# EAGLE design Proyecto_Reinaldo (EAGLE 7.6.0)
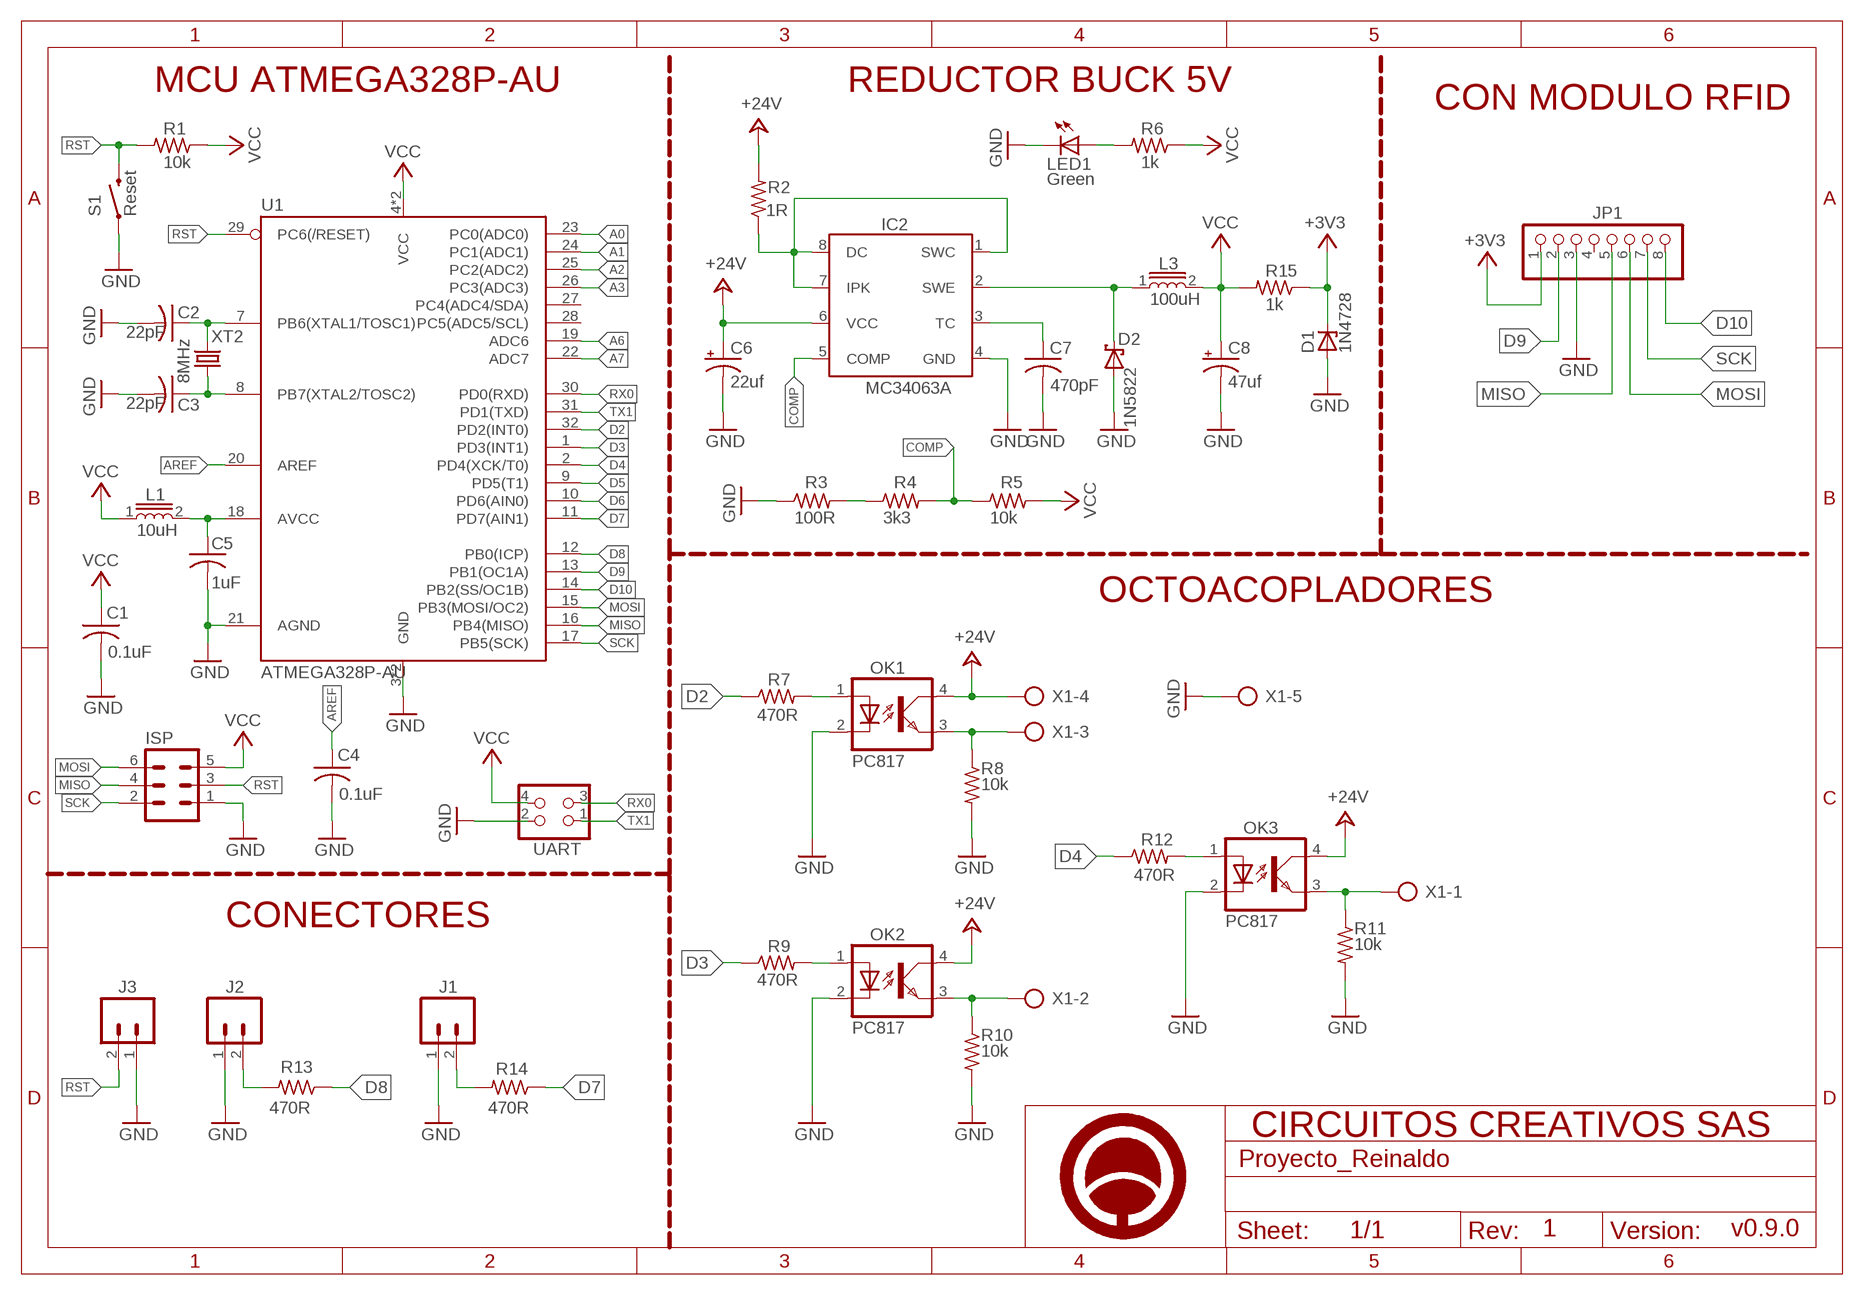
[diagram p0: schematic, sheet 1]

## Parts
C1  0.1uF  C-USC0805  [C0805]
C2  22pF  C-USC0805  [C0805]
C3  22pF  C-USC0805  [C0805]
C4  0.1uF  C-USC0805  [C0805]
C5  1uF  C-USC0805  [C0805]
C6  22uf  CPOL-USE2,5-6E  [E2,5-6E]
C7  470pF  C-USC0805  [C0805]
C8  47uf  CPOL-USE2,5-6E  [E2,5-6E]
D1  1N4728  [DO41Z10]
D2  1N5822  [DO-214AC]
IC2  MC34063A  [SOIC-8]
ISP  MA03-2  [MA03-2]
J1  M02LOCK  [1X02_LOCK]
J2  M02LOCK  [1X02_LOCK]
J3  M02LOCK  [1X02_LOCK]
JP1  PINHD-1X8BIG  [1X08-BIG]
L1  10uH  FERRITA-CHOKE  [L0805]
L3  100uH  CD54  [CD54]
LED1  Green  LEDCHIPLED_0805  [CHIPLED_0805]
OK1  PC817  [DIL04]
OK2  PC817  [DIL04]
OK3  PC817  [DIL04]
R1  10k  RESISTORR1206  [R1206]
R2  1R  RESISTORR1206  [R1206]
R3  100R  RESISTORR1206  [R1206]
R4  3k3  RESISTORR1206  [R1206]
R5  10k  RESISTORR1206  [R1206]
R6  1k  RESISTORR1206  [R1206]
R7  470R  RESISTORR1206  [R1206]
R8  10k  RESISTORR1206  [R1206]
R9  470R  RESISTORR1206  [R1206]
R10  10k  RESISTORR1206  [R1206]
R11  10k  RESISTORR1206  [R1206]
R12  470R  RESISTORR1206  [R1206]
R13  470R  RESISTORR1206  [R1206]
R14  470R  RESISTORR1206  [R1206]
R15  1k  R-US_R1206  [R1206]
S1  Reset  SWITCH-MOMENTARY-2-SMD-1101NE  [TACTILE-SWITCH-1101NE]
U1  ATMEGA328P-AU  [TQFP32]
U$1  A4_HORIZONTAL  [LOGO]
UART  IPS_CIRCUITOS  [ISP_CIRCUITOS]
X1  AK500/5  [AK500/5]
XT2  8MHz  CRYSTALSM49  [SM49]

## Nets
+3V3: D1.C JP1.1 R15.1
+24V: C6.+ IC2.6(VCC) OK1.4(COL) OK2.4(COL) OK3.4(COL) R2.2 X1.4
A0: U1.23(PC0(ADC0))
A1: U1.24(PC1(ADC1))
A2: U1.25(PC2(ADC2))
A3: U1.26(PC3(ADC3))
A6: U1.19(ADC6)
A7: U1.22(ADC7)
AREF: C4.1 U1.20(AREF)
COMP: IC2.5(COMP) R4.2 R5.1
D2: R7.1 U1.32(PD2(INT0))
D3: R9.1 U1.1(PD3(INT1))
D4: R12.1 U1.2(PD4(XCK/T0))
D5: U1.9(PD5(T1))
D6: U1.10(PD6(AIN0))
D7: R14.1 U1.11(PD7(AIN1))
D8: R13.1 U1.12(PB0(ICP))
D9: JP1.2 U1.13(PB1(OC1A))
D10: JP1.8 U1.14(PB2(SS/OC1B))
GND: C1.2 C2.2 C3.2 C4.2 C5.2 C6.- C7.2 C8.- D1.A D2.A IC2.4(GND) ISP.1 J1.1 J2.1 J3.1 JP1.3 LED1.C OK1.2(C) OK2.2(C) OK3.2(C) R3.1 R8.2 R10.2 R11.2 S1.P$1 U1.3(GND) U1.5(GND) U1.21(AGND) UART.2 X1.5
MISO: ISP.4 JP1.5 U1.16(PB4(MISO))
MOSI: ISP.6 JP1.6 U1.15(PB3(MOSI/OC2))
N$1: OK1.1(A) R7.2
N$2: OK2.1(A) R9.2
N$5: OK3.1(A) R12.2
N$8: J2.2 R13.2
N$9: J1.2 R14.2
N$13: LED1.A R6.2
N$14: C7.1 IC2.3(TC)
N$16: IC2.1(SWC) IC2.7(IPK) IC2.8(DC) R2.1
N$17: R3.2 R4.1
N$18: C5.1 L1.2 U1.18(AVCC)
N$19: D2.K IC2.2(SWE) L3.1
OK1: OK1.3(EMIT) R8.1 X1.3
OK2: OK2.3(EMIT) R10.1 X1.2
OK3: OK3.3(EMIT) R11.1 X1.1
OS1: C2.1 U1.7(PB6(XTAL1/TOSC1)) XT2.2
OS2: C3.1 U1.8(PB7(XTAL2/TOSC2)) XT2.1
RST: ISP.3 J3.2 R1.2 S1.P$2 U1.29(PC6(/RESET))
RX0: U1.30(PD0(RXD)) UART.3
SCK: ISP.2 JP1.7 U1.17(PB5(SCK))
TX1: U1.31(PD1(TXD)) UART.1
VCC: C1.1 C8.+ ISP.5 L1.1 L3.2 R1.1 R5.2 R6.1 R15.2 U1.4(VCC) U1.6(VCC) UART.4
Unconnected: JP1.4 U1.27(PC4(ADC4/SDA)) U1.28(PC5(ADC5/SCL))

## Notes on the sheet
- MCU ATMEGA328P-AU | REDUCTOR BUCK 5V
- CON MODULO RFID
- OCTOACOPLADORES
- CONECTORES
- 1 | v0.9.0

## Library data of the parts
C1-C5 C7 = rcl:C-US: CAPACITOR, American symbol
C6 C8 = adafruit:CPOL-US: POLARIZED CAPACITOR, American symbol
D1 = diode:1N4728: Z DIODE 3.3 V, 1W, 5 percent
D2 = Circuitos-Creativos-Diodos:1N5822: Diodo de barrera Schottky Repetitive peak reverse voltage (VRRM): 40V, IRMS: 3A
IC2 = Circuitos-Creativos-Integrados-8pin:MC34063A: Convertidor DC/DC elevador,reductor, inversor 40V - 1.5A
ISP = con-lstb:MA03-2: PIN HEADER; OC_FARNELL: unknown; OC_NEWARK: unknown
J1-J3 = SparkFun-Connectors:M02: Standard 2-pin 0.1" header. Use with - straight break away headers ( PRT-00116) - right angle break away headers (PRT-00553) - swiss pins (PRT-00743) - machine pins (PRT-00117) - female headers (PRT-00115) Molex polarized connector foot print use with: PRT-08233 with associated crimp pins and housings. 2.54_SCREWTERM for use with PRT-10571. 3.5mm Screw Terminal footprints for PRT-08084 5mm Screw Terminal footprints for use with PRT-08432
JP1 = adafruit:PINHD-1X8: PIN HEADER
L1 = Circuitos-Creativos-RCL:FERRITA-CHOKE: Inductor para altas frecuencias 47nH - 50mOhms
L3 = Circuitos-Creativos-RCL:CD54: Power inductor SMD de la serie CD54
LED1 = led:LED: LED OSRAM: - CHIPLED LG R971, LG N971, LY N971, LG Q971, LY Q971, LO R971, LY R971 LH N974, LH R974 LS Q976, LO Q976, LY Q976 LO Q996 - Hyper CHIPLED LW Q18S LB Q993, LB Q99A, LB R99A - SideLED LS A670, LO A670, LY A670, LG A670, LP A670 LB A673, LV A673, LT A673, LW A673 LH A674 LY A675 LS A676, LA A676, LO A676, LY A676, LW A676 LS A679, LY A679, LG A679 - Hyper Micro SIDELED® LS Y876, LA Y876, LO Y876, LY Y876 LT Y87S - SmartLED LW L88C, LW L88S LB L89C, LB L89S, LG L890 LS L89K, LO L89K, LY L89K LS L896, LA L896, LO L896, LY L896 - TOPLED LS T670, LO T670, LY T670, LG T670, LP T670 LSG T670, LSP T670, LSY T670, LOP T670, LYG T670 LG T671, LOG T671, LSG T671 LB T673, LV T673, LT T673, LW T673 LH T674 LS T676, LA T676, LO T676, LY T676, LB T676, LH T676, LSB T676, LW T676 LB T67C, LV T67C, LT T67C, LS T67K, LO T67K, LY T67K, LW E67C LS E67B, LA E67B, LO E67B, LY E67B, LB E67C, LV E67C, LT E67C LW T67C LS T679, LY T679, LG T679 LS T770, LO T770, LY T770, LG T770, LP T770 LB T773, LV T773, LT T773, LW T773 LH T774 LS E675, LA E675, LY E675, LS T675 LS T776, LA T776, LO T776, LY T776, LB T776 LHGB T686 LT T68C, LB T68C - Hyper Mini TOPLED® LB M676 - Mini TOPLED Santana® LG M470 LS M47K, LO M47K, LY M47K Source: http://www.osram.convergy.de LUXEON: - LUMILED® LXK2-PW12-R00, LXK2-PW12-S00, LXK2-PW14-U00, LXK2-PW14-V00 LXK2-PM12-R00, LXK2-PM12-S00, LXK2-PM14-U00 LXK2-PE12-Q00, LXK2-PE12-R00, LXK2-PE12-S00, LXK2-PE14-T00, LXK2-PE14-U00 LXK2-PB12-K00, LXK2-PB12-L00, LXK2-PB12-M00, LXK2-PB14-N00, LXK2-PB14-P00, LXK2-PB14-Q00 LXK2-PR12-L00, LXK2-PR12-M00, LXK2-PR14-Q00, LXK2-PR14-R00 LXK2-PD12-Q00, LXK2-PD12-R00, LXK2-PD12-S00 LXK2-PH12-R00, LXK2-PH12-S00 LXK2-PL12-P00, LXK2-PL12-Q00, LXK2-PL12-R00 Source: www.luxeon.com KINGBRIGHT: KA-3528ASYC Source: www.kingbright.com
OK1-OK3 = optocoupler:PC817: SHARP OPTO COUPLER; MPN: PC817X4J000F; OC_FARNELL: 9707727; OC_NEWARK: 97K7059
R1-R14 = Circuitos-Creativos-RCL:RESISTOR: RESISTOR, simbolo Americano
R15 = rcl:R-US_: RESISTOR, American symbol
S1 = Testing:SWITCH-MOMENTARY-2: Various NO switches- pushbuttons, reed, etc
U1 = Circuitos-Creativos-Integrados-MCUs:ATMEGA328P: Microcontrolador AVR de 8 bits 32KB memoria Flash
U$1 = Circuitos-Creativos-Estilos:A4_HORIZONTAL
UART = isp_circuitos:IPS_CIRCUITOS
X1 = con-ptr500:AK500/5: CONNECTOR; OC_FARNELL: unknown; OC_NEWARK: unknown
XT2 = crystal:CRYSTAL: CRYSTAL; OC_FARNELL: unknown; OC_NEWARK: unknown

## Board
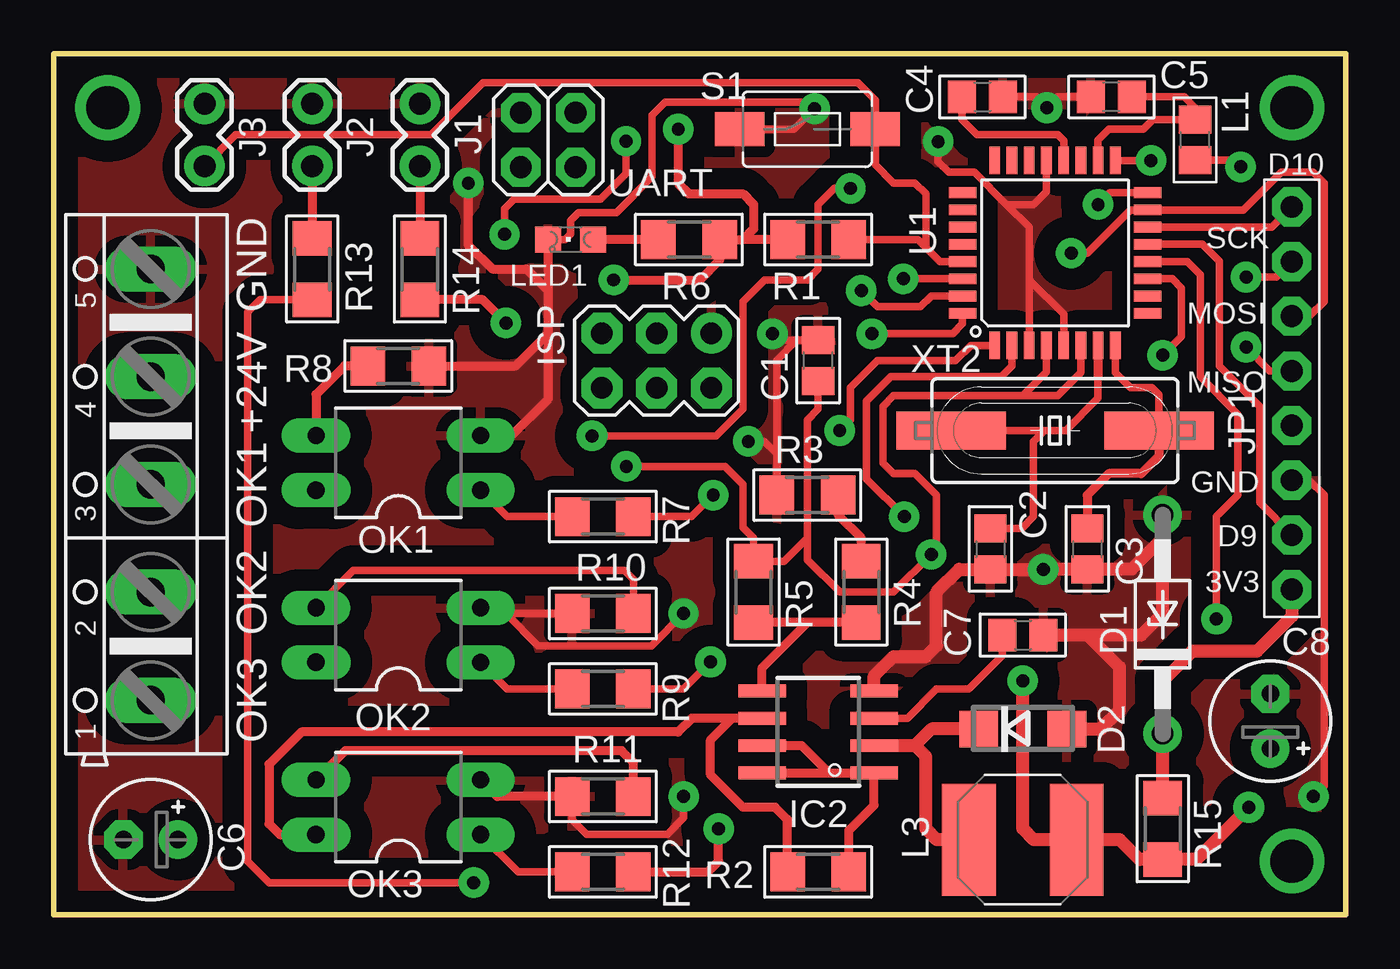
[diagram p1: board, top side]
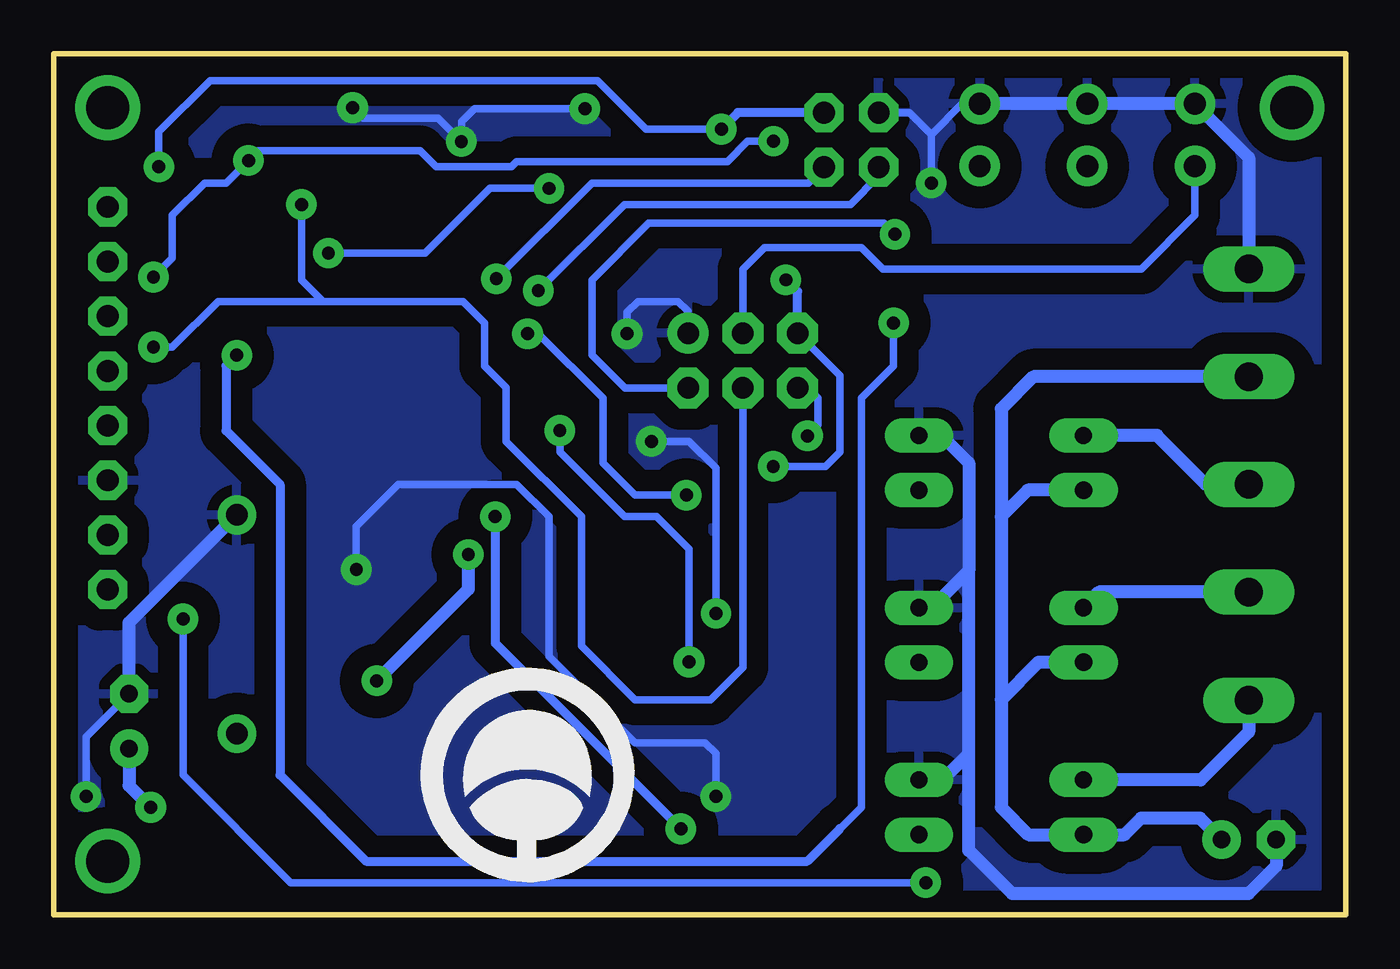
[diagram p2: board, bottom side, seen from below]

Size 60 x 40 mm. Coordinates in mm from the lower left corner, seen from the top.
Outline: 0,0 60,0 60,40 0,40 0,0
Copper layers (1*16): Top 0.035mm / dielectric 1.5mm / Bottom 0.035mm
Design rules "Crcuitos creativos *": minimum track width 0.35mm, minimum drill 0.6mm, track to track 10mil, track to pad 10mil, pad to pad 10mil, via to via 10mil, smd to smd 8mil, copper to edge 0.5mm, drill to drill 0.3mm, minimum pad ring 0.4mm, minimum via ring 0.4mm, stop-mask expansion 4mil, vias tented up to drill 0mil, thermal gap 20mil

### Footprints (pad centres in the part's own frame; a part is rotated, then mirrored left to right if it is on the bottom)
C0805 = smd 1.3 x 1.5: 1 -0.95,0; 2 0.95,0
E2,5-6E = drill 0.813 pad 1.778: + -1.27,0 | drill 0.813 pad 1.778 octagon: - 1.27,0
DO41Z10 = drill 1 pad 1.778: A 5.08,0; C -5.08,0
DO-214AC = smd 1.8 x 1.7: A 2.05,0; K -2.05,0
SOIC-8 = smd 0.6 x 2.2: 1 -1.905,-2.6; 2 -0.635,-2.6; 3 0.635,-2.6; 4 1.905,-2.6; 5 1.905,2.6; 6 0.635,2.6; 7 -0.635,2.6; 8 -1.905,2.6
MA03-2 = drill 1 pad 1.9: 1 -2.54,-1.27 | drill 1 pad 1.9 octagon: 2 -2.54,1.27; 3 0,-1.27; 4 0,1.27; 5 2.54,-1.27; 6 2.54,1.27
1X02_LOCK = drill 1.016 pad 1.88: 1 -0.178,0; 2 2.718,0
1X08-BIG = drill 1.016 pad 1.778 octagon: 1 -8.89,0; 2 -6.35,0; 3 -3.81,0; 4 -1.27,0; 5 1.27,0; 6 3.81,0; 7 6.35,0; 8 8.89,0
L0805 = smd 1.3 x 1.5: 1 -0.95,0; 2 0.95,0
CD54 = smd 5.2 x 2.5: 1 0,2.5; 2 0,-2.5
CHIPLED_0805 = smd 1.2 x 1.2: A 0,-1.05; C 0,1.05
DIL04 = drill 0.8 long: 1 -1.27,-3.82; 2 1.27,-3.82; 3 1.27,3.82 | drill 0.813 long: 4 -1.27,3.82
R1206 = smd 1.6 x 1.803: 1 -1.422,0; 2 1.422,0
TACTILE-SWITCH-1101NE = smd 2.3 x 1.6: P$1 -3.15,0; P$2 3.15,0
TQFP32 = smd 1.27 x 0.5: 1 -4.293,2.8; 2 -4.293,2; 3 -4.293,1.2; 4 -4.293,0.4; 5 -4.293,-0.4; 6 -4.293,-1.2; 7 -4.293,-2; 8 -4.293,-2.8; 17 4.293,-2.8; 18 4.293,-2; 19 4.293,-1.2; 20 4.293,-0.4; 21 4.293,0.4; 22 4.293,1.2; 23 4.293,2; 24 4.293,2.8 | smd 0.5 x 1.27: 9 -2.8,-4.293; 10 -2,-4.293; 11 -1.2,-4.293; 12 -0.4,-4.293; 13 0.4,-4.293; 14 1.2,-4.293; 15 2,-4.293; 16 2.8,-4.293; 25 2.8,4.293; 26 2,4.293; 27 1.2,4.293; 28 0.4,4.293; 29 -0.4,4.293; 30 -1.2,4.293; 31 -2,4.293; 32 -2.8,4.293
ISP_CIRCUITOS = drill 1.016 pad 1.676 octagon: 1 -3.81,-1.27; 2 -3.81,1.27; 3 -1.27,-1.27; 4 -1.27,1.27
AK500/5 = drill 1.321 long: 1 -10.033,0; 2 -5.004,0; 3 0,0; 4 5.004,0; 5 10.008,0
SM49 = smd 5.08 x 1.778: 1 -4.826,0; 2 4.826,0

### Placement (x,y rotation side)
C1  35.5,25.75 90 top
C2  43.5,17 270 top
C3  48,17 270 top
C4  43.12,38 0 top
C5  49.12,38 180 top
C6  4.5,3.5 180 top
C7  45,13 0 top
C8  56.5,9 90 top
D1  51.5,13.5 90 top
D2  45,8.63 0 top
IC2  35.5,8.5 90 top
ISP  28,25.75 180 top
J1  17,37.5 270 top
J2  12,37.5 270 top
J3  7,37.5 270 top
JP1  57.5,24 90 top
L1  53,36 90 top
L3  45,3.5 90 top
LED1  24,31.38 90 top
OK1  16,21 90 top
OK2  16,13 90 top
OK3  16,5 90 top
R1  35.5,31.38 0 top
R2  35.5,2 180 top
R3  35,19.5 0 top
R4  37.5,15 270 top
R5  32.5,15 90 top
R6  29.5,31.38 180 top
R7  25.5,18.5 180 top
R8  16,25.5 0 top
R9  25.5,10.5 180 top
R10  25.5,14 180 top
R11  25.5,5.5 180 top
R12  25.5,2 180 top
R13  12,30 90 top
R14  17,30 90 top
R15  51.5,4 270 top
S1  35,36.5 0 top
U1  46.5,30.75 90 top
U$1  38,6.5 0 bottom
UART  25.5,36 0 top
X1  4.5,20 90 top
XT2  46.5,22.5 180 top

### Tracks (layer width: path | path; a pad name or v marks a point on that pad's centre or on a via)
+3V3
  Top 0.61: R15.1 D1.C 51.5,10.88 52.88,12.25 55.88,12.25 57.5,13.88 JP1.1
+24V
  Top 0.406: IC2.6 31.5,9.13 | 31.5,9.13 29.64,9.13 29,8.5 11.5,8.5 10,7 10,4.23 10.5,3.73 OK3.4 | R2.2 34.08,4.42 33.5,5 32,5 30.5,6.5 30.5,8.13 31.5,9.13
  Bottom 0.61: OK1.4 14.77,19.73 16,18.5 | 16,18.5 16,10 | 16,10 16,5 14.73,3.73 OK3.4 10.27,3.73 9.5,4.5 6.77,4.5 C6.+ | OK2.4 14.27,11.73 16,10 | X1.4 14.5,25 16,23.5 16,18.5
AREF
  Top 0.35: U1.20 46.9,35.98 46.62,36.25 42.88,36.25 42.17,36.95 C4.1
COMP
  Top 0.406: R4.2 35,13.58 | 35,13.58 R5.1 | IC2.5 32.9,11.48 35,13.58
D2  (via drill 0.6 pad 1.42)
  Top 0.35: U1.32 42.21,27.46 41.75,27 v38,27 | R7.1 29.62,18.5 v30.62,19.5
  Bottom 0.35: v30.62,19.5 33,19.5 34.5,21 34.5,24 37.5,27 v38,27
D3  (via drill 0.6 pad 1.42)
  Top 0.35: U1.1 42.58,26.46 41.88,25.75 38.25,25.75 37,24.5 37,23 v36.5,22.5 | R9.1 29.25,10.5 v30.5,11.75
  Bottom 0.35: v36.5,22.5 36.5,21.5 33.5,18.5 32,18.5 30.5,17 v30.5,11.75
D4  (via drill 0.6 pad 1.42)
  Top 0.35: U1.2 44.5,25.5 44,25 38.88,25 37.75,23.88 37.75,20.25 v39.5,18.5
  Top 0.406: R12.1 30.38,2 30.88,2.5 v30.88,4
  Bottom 0.406: v39.5,18.5 39.5,12.62 v30.88,4
D7  (via drill 0.6 pad 1.42)
  Top 0.35: U1.11 51.95,29.55 52.38,29.12 52.38,26.88 v51.5,26
  Top 0.406: v21,27.5 19.92,28.58 R14.1
  Bottom 0.35: v21,27.5 21,25.5 22.5,24 22.5,5 23.5,4
  Bottom 0.406: 23.5,4 25,2.5 45.5,2.5 49.5,6.5 49.5,20 52,22.5 52,25.5 v51.5,26
D8  (via drill 0.6 pad 1.42)
  Top 0.35: U1.12 52.65,30.35 53.25,29.75 53.25,25 55,23.25 55,19.5 54,18.5 v54,13.75 | R13.1 9.58,28.58 9,28 9,2.5 10,1.5 v19.5,1.5
  Bottom 0.35: v19.5,1.5 49,1.5 54,6.5 v54,13.75
D9
  Top 0.35: U1.13 53.35,31.15 54.12,30.38 54.12,25.5 56,23.62 56,19.15 JP1.2
D10
  Top 0.35: U1.14 56.56,31.95 JP1.8
GND  (via drill 0.6, 0.6 pad 1.42)
  Top 0.35: JP1.3 58.31,20.19 59,19.5 59,6 v58.5,5.5 | C1.2 34.5,26.7 | 34.5,26.7 33.67,26.7 v33.38,27 | U1.3 45.3,29.5 | 45.3,29.5 45.3,31.95 44.25,33 | U1.5 46.9,27.9 45.3,29.5 | C5.2 46.62,38 v46.12,37.5 45.62,38 C4.2 | U1.21 46.1,33.6 45.5,33 44.25,33 | 44.25,33 42.75,34.5 41.57,34.5 41.07,35 v41.07,35.93 | R11.2 24.08,4.42 24.75,3.75 28.5,3.75 29.25,4.5 v29.25,5.5 | LED1.C 23.75,31.38 24,31.62 24,32.25 24.38,32.62 26.12,32.62 27.78,34.28 27.78,37.15 28.39,37.75 35.03,37.75 v35.33,37.45 34.39,36.5 S1.P$1 | v29.25,14 27.75,12.5 22.5,12.5 21,14 | R10.2 21,14 | 21,14 20.09,14 OK2.2 | v32.25,22 33,22 33.58,21.42 | 33.58,21.42 33.58,25.78 34.5,26.7 | 33.58,21.42 R3.1
  Top 0.406: LED1.C 22.95,29 | 22.95,29 22.95,27 | 22.95,27 22.95,23.95 21.27,22.27 OK1.2 | R8.2 21.45,25.5 22.95,27 | R11.2 20.59,5.5 OK3.2 | v19.25,34 19.25,31.12 20.38,30 21.95,30 22.95,29
  Top 0.61: D1.A 51.5,17.5 | 51.5,17.5 50.05,16.05 C3.2 v45.95,16.05 C2.2 42.05,16.05 41,15 41,12.5 40.5,12 39,12 38.1,11.1 IC2.4 | C7.2 48,13 | 48,13 50.5,13 51.5,14 51.5,17.5 | D2.A 48.63,8.63 49.5,9.5 49.5,11.5 48,13
  Bottom 0.35: v58.5,5.5 58.5,8.27 C8.- | v33.38,27 33.38,28 32.88,28.5 31,28.5 30.54,28.04 ISP.1 | v46.12,37.5 45.62,37 42.14,37 v41.07,35.93 41.07,36.84 40.47,37.45 v35.33,37.45 | v29.25,5.5 29.25,7.5 29.75,8 33,8 37,12 37,18.5 38.5,20 44,20 45.95,18.05 v45.95,16.05 | UART.2 20.27,37.27 19.25,36.25 | 19.25,36.25 v19.25,34 | J1.1 17.82,37.68 19.25,36.25 | v29.25,14 29.25,20.75 30.5,22 v32.25,22
  Bottom 0.61: OK3.2 18.73,6.27 17.5,7.5 | 17.5,7.5 17.5,16 | OK2.2 19.23,14.27 17.5,16 | OK1.2 18.77,22.27 17.5,21 17.5,16 | C6.- 3.23,2.27 4.5,1 15.5,1 17.5,3 17.5,7.5 | J1.1 J2.1 J3.1 4.5,35.18 X1.5 | C8.- 56.5,13.58 D1.A
  pour Bottom (isolate 1): -1,-1 61,-1 61,41 -1,41
  pour Top (isolate 1): -0.5,-0.5 60.5,-0.5 60.5,40.5 -0.5,40.5
MISO  (via drill 0.6 pad 1.42)
  Top 0.35: U1.16 49.05,33.55 v48.5,33 | JP1.5 56.48,25.27 v55.38,26.38
  Bottom 0.35: v48.5,33 48.5,29.5 47.5,28.5 | 47.5,28.5 52.38,28.5 54.5,26.38 v55.38,26.38 | 47.5,28.5 41,28.5 40,27.5 40,25.5 39,24.5 39,22 35.5,18.5 35.5,12.5 33,10 29.5,10 28,11.5 ISP.4
MOSI  (via drill 0.6, 0.6 pad 1.42)
  Top 0.35: v47.25,30.75 48,30.75 50,32.75 U1.15 55.25,32.75 57,34.5 58.5,34.5 59,34 59,28.5 58.31,27.81 JP1.6 | v37,33.75 36.25,33.75 35.5,33 35.5,30 35,29.5 33,29.5 32,28.5 32,23.5 30.75,22.25 v25,22.25
  Bottom 0.35: v37,33.75 39.75,33.75 42.75,30.75 v47.25,30.75 | ISP.6 24.98,24.48 24.5,24 24.5,22.75 v25,22.25
N$1
  Top 0.35: R7.2 21.05,18.5 OK1.1
N$2
  Top 0.35: R9.2 21.05,10.5 OK2.1
N$5
  Top 0.35: R12.2 21.55,2 OK3.1
N$8
  Top 0.406: J2.2 R13.2
N$9
  Top 0.406: J1.2 R14.2
N$10  (via drill 2 pad 3)
  other vias: 2.5,37.5
N$12  (via drill 2 pad 3)
  other vias: 57.5,2.5
N$13
  Top 0.406: R6.2 LED1.A
N$14
  Top 0.35: C7.1 44.05,12.05 42.5,10.5 41,10.5 39.63,9.13 IC2.3
N$15  (via drill 2 pad 3)
  other vias: 57.5,37.5
N$16
  Top 0.406: IC2.8 36,6.59 | 36,6.59 IC2.1 38.1,5.1 36.92,3.92 R2.1 | IC2.7 34.73,7.87 36,6.59
N$17
  Top 0.406: R4.1 37.5,17.5 36.42,18.58 R3.2
N$18
  Top 0.35: U1.18 48.5,36 49,36.5 50.6,36.5 51.05,36.95 L1.2 53,37.5 52.5,38 C5.1
N$19
  Top 0.61: IC2.2 40,7.87 | D2.K 40.77,8.63 40,7.87 | L3.1 41,3.5 40.5,4 40.5,7.37 40,7.87
OK1
  Top 0.406: R8.1 13.5,25.5 12.18,24.18 OK1.3
  Bottom 0.61: X1.3 6.5,20 8.77,22.27 OK1.3
OK2
  Top 0.35: R10.1 26.92,15.58 26.5,16 13.91,16 OK2.3
  Bottom 0.61: X1.2 11.45,15 OK2.3
OK3
  Top 0.406: R11.1 26.92,7.08 26.38,7.62 13.54,7.62 OK3.3
  Bottom 0.61: X1.1 4.5,8.5 6.73,6.27 OK3.3
OS1
  Top 0.35: 46,22.5 47,22.5 48.5,24 48.5,25 | 46,22.5 XT2.2 | C2.1 44.95,17.95 45.5,18.5 45.5,22 46,22.5
  Top 0.406: U1.7 48.5,25
OS2
  Top 0.35: U1.8 49.3,25.2 50,24.5 51,24.5 51.33,24.17 XT2.1
  Top 0.406: XT2.1 51.33,21.33 50.5,20.5 49,20.5 48,19.5 C3.1
RST
  Top 0.35: U1.29 41.15,30.35 40.5,31 | R1.2 40.12,31.38 40.5,31 | 40.5,31 40.5,33.5 40,34 39,34 38.15,34.85 S1.P$2 38.15,37.85 37.34,38.66 19.93,38.66 17.52,36.24 8.46,36.24 J3.2
  Bottom 0.35: ISP.3 28,30 27,31 22.5,31 21.5,30 9.5,30 7,32.5 J3.2
RX0  (via drill 0.6 pad 1.42)
  Top 0.35: U1.30 v39.45,29.55
  Bottom 0.35: v39.45,29.55 35,34 24.96,34 UART.3
SCK  (via drill 0.6, 0.6 pad 1.42)
  Top 0.35: v55.38,29.62 56.77,29.62 JP1.7 | U1.17 v50.96,35.04 | v26.58,35.94 26.58,34.43 25.4,33.25 21.38,33.25 20.94,32.82 v20.94,31.62
  Bottom 0.35: v55.38,29.62 54.5,30.5 54.5,32.5 53,34 52,34 v50.96,35.04 50.5,35.5 43,35.5 42.25,34.75 38.75,34.75 38.5,35 28.72,35 27.78,35.94 v26.58,35.94 | ISP.2 33.48,24.48 35,26 35,29.5 32.38,32.12 21.45,32.12 v20.94,31.62
TX1  (via drill 0.6 pad 1.42)
  Top 0.35: U1.31 40.75,28.75 40.25,28.25 38.25,28.25 v37.5,29
  Bottom 0.35: v37.5,29 33.5,33 23,33 21.69,34.31 UART.1
VCC  (via drill 0.6, 0.6 pad 1.42)
  Top 0.35: U1.6 47.7,25.2 46.62,24.12 45,24.12 | 45,24.12 39,24.12 38.5,23.62 38.5,21 39,20.5 40,20.5 41,19.5 41,17 v40.75,16.75 39,15 36.5,15 35,16.5 35,17.5 | U1.4 46.1,25.23 45,24.12 | C1.1 35.5,23.5 35,23 35,17.5 | 35,17.5 33.92,16.42 R5.2 32.5,17.5 32,18 32,20 31.16,20.84 v26.59,20.84 | L1.1 54.83,35.05 v55.12,34.75
  Top 0.406: 32,31.38 R6.1 30.92,30.42 30,29.5 v26,29.5 | v29,36.5 29,34 29.5,33.5 32,33.5 32.5,33 32.5,31.88 32,31.38 | R1.1 32,31.38
  Top 0.61: v55.5,5 53.08,2.58 R15.2 50.42,2.58 49.5,3.5 L3.2 45.5,3.5 45,4 v45,10.88
  Bottom 0.35: v55.12,34.75 55.12,36.38 52.75,38.75 34.75,38.75 32.5,36.5 v29,36.5 | v26.59,20.84 24.16,20.84 23.5,21.5 23.5,25.06 ISP.5
  Bottom 0.406: UART.4 28.23,37.27 v29,36.5 | ISP.5 25.46,28.96 v26,29.5
  Bottom 0.61: C8.+ 56.5,6 v55.5,5 | v40.75,16.75 40.75,15.12 v45,10.88

### Text on the board
tPlace: D10 | SCK | GND | MOSI | MISO | +24V | GND | OK1 | D9 | 3V3 | OK2 | OK3